# Altium schematic sheet conn.SchDoc
size A4; DocumentNumber: 11; SheetNumber: 11; SheetTotal: 11
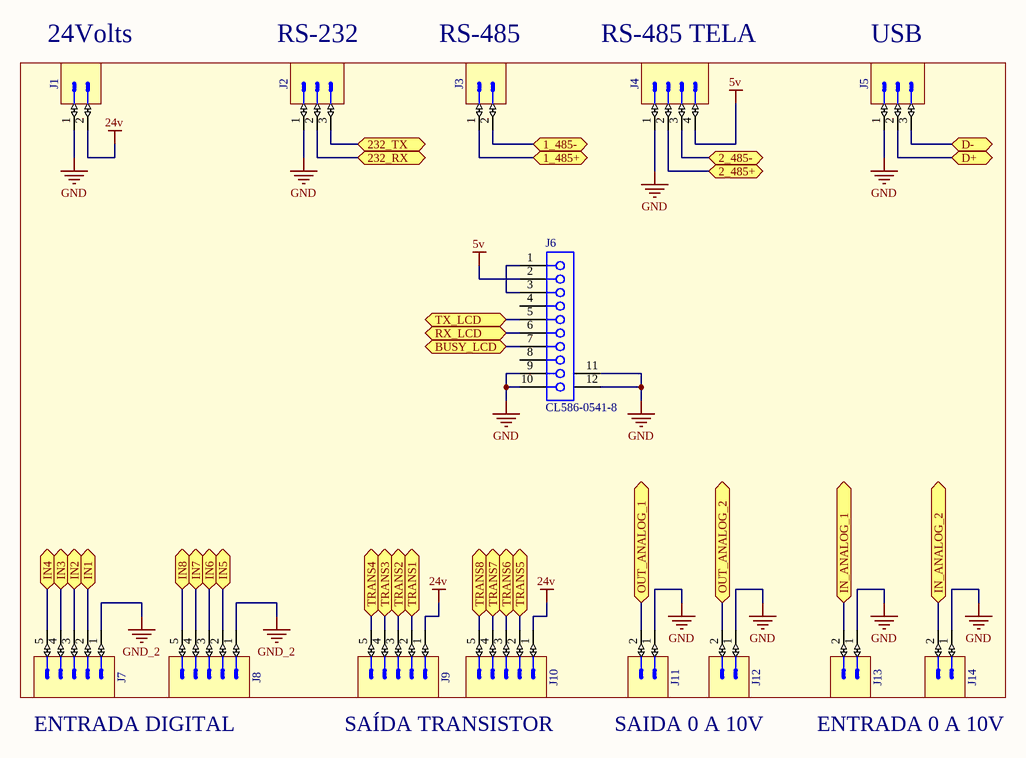
[diagram p0: conn.SchDoc]

## Parts
J1  (no value)  [PHOENIX_1757242]
J2  (no value)  [PHOENIX_1757255]
J3  (no value)  [PHOENIX_1757242]
J4  (no value)  [PHOENIX_1757268]
J5  (no value)  [PHOENIX_1757255]
J6  CL586-0541-8  [FH12-22(10)SA-1SH]
J7  (no value)  [PHOENIX_1803303]
J8  (no value)  [PHOENIX_1803303]
J9  (no value)  [PHOENIX_1803303]
J10  (no value)  [PHOENIX_1803303]
J11  (no value)  [PHOENIX_1757242]
J12  (no value)  [PHOENIX_1757242]
J13  (no value)  [PHOENIX_1757242]
J14  (no value)  [PHOENIX_1757242]

## Ports
1_485+, 1_485-, 2_485+, 2_485-, 232_RX, 232_TX, BUSY_LCD, D+, D-, IN1, IN2, IN3, IN4, IN5, IN6, IN7, IN8, IN_ANALOG_1, IN_ANALOG_2, OUT_ANALOG_1, OUT_ANALOG_2, RX_LCD, TRANS1, TRANS2, TRANS3, TRANS4, TRANS5, TRANS6, TRANS7, TRANS8, TX_LCD

## Nets
5v: J4.4 J6.2
24v: J1.2 J9.1 J10.1
GND: J1.1 J2.1 J4.1 J5.1 J6.9 J6.10 J6.11(MH1) J6.12(MH2) J11.1 J12.1 J13.1 J14.1
GND_2: J7.1 J8.1
1_485+: J3.1 ; port 1_485+
1_485-: J3.2 ; port 1_485-
2_485+: J4.2 ; port 2_485+
2_485-: J4.3 ; port 2_485-
232_RX: J2.2 ; port 232_RX
232_TX: J2.3 ; port 232_TX
BUSY_LCD: J6.7 ; port BUSY_LCD
D+: J5.2 ; port D+
D-: J5.3 ; port D-
IN1: J7.2 ; port IN1
IN2: J7.3 ; port IN2
IN3: J7.4 ; port IN3
IN4: J7.5 ; port IN4
IN5: J8.2 ; port IN5
IN6: J8.3 ; port IN6
IN7: J8.4 ; port IN7
IN8: J8.5 ; port IN8
IN_ANALOG_1: J13.2 ; port IN_ANALOG_1
IN_ANALOG_2: J14.2 ; port IN_ANALOG_2
OUT_ANALOG_1: J11.2 ; port OUT_ANALOG_1
OUT_ANALOG_2: J12.2 ; port OUT_ANALOG_2
RX_LCD: J6.6 ; port RX_LCD
TRANS1: J9.2 ; port TRANS1
TRANS2: J9.3 ; port TRANS2
TRANS3: J9.4 ; port TRANS3
TRANS4: J9.5 ; port TRANS4
TRANS5: J10.2 ; port TRANS5
TRANS6: J10.3 ; port TRANS6
TRANS7: J10.4 ; port TRANS7
TRANS8: J10.5 ; port TRANS8
TX_LCD: J6.5 ; port TX_LCD
NetJ6_1: J6.1 J6.3

Not connected (* = marked no-connect by the designer): J6 4 8

## Notes on the sheet
- 24Volts
- RS-232
- RS-485
- RS-485 TELA
- USB
- ENTRADA DIGITAL
- SAÍDA TRANSISTOR
- SAIDA 0 A 10V
- ENTRADA 0 A 10V

## Library data of the parts
J1 J3 J11-J14 = PHOENIX_1757242: Connector 2 Male; Part Description: 12A, 250V, Pitch 5.08mm, 2 Positions Header; Manufacturer: PHOENIX CONTACT; Manufacturer Part Number: 1757242 (MSTBA 2,5/ 2-G-5,08); Part Number: PHOENIX_1757242; Component Kind: Standard; Component Type: Standard; Pin Count: 2; Mounted: Yes; Socket: No; SMD: No; Status: None; ComponentHeight: 8.6mm; HelpURL: \\cern.ch\dfs\Applications\Altium\Datasheets\PHOENIX_1757242.pdf; Author: CERN DEM JLC; CreateDate: 10/02/2010; LatestRevisionDate: 26/04/2010; Table: PHOENIX
J2 J5 = PHOENIX_1757255: Connector 3 Male; Part Description: 12A, 250V, Pitch 5.08mm, 3 Positions Header; Manufacturer: PHOENIX CONTACT; Manufacturer Part Number: 1757255 (MSTBA 2,5/ 3-G-5,08); Part Number: PHOENIX_1757255; Component Kind: Standard; Component Type: Standard; Pin Count: 3; Mounted: Yes; Socket: No; SMD: No; Status: None; ComponentHeight: 8.6mm; HelpURL: \\cern.ch\dfs\Applications\Altium\Datasheets\PHOENIX_1757255.pdf; Author: CERN DEM JLC; CreateDate: 10/02/2010; LatestRevisionDate: 26/04/2010; Table: PHOENIX
J4 = PHOENIX_1757268: Connector 4 Male; Part Description: 12A, 250V, Pitch 5.08mm, 4 Positions Header; Manufacturer: PHOENIX CONTACT; Manufacturer Part Number: 1757268 (MSTBA 2,5/ 4-G-5,08); Part Number: PHOENIX_1757268; Component Kind: Standard; Component Type: Standard; Pin Count: 4; Mounted: Yes; Socket: No; SMD: No; Status: None; ComponentHeight: 8.6mm; HelpURL: \\cern.ch\dfs\Applications\Altium\Datasheets\PHOENIX_1757268.pdf; Author: CERN DEM JLC; CreateDate: 10/02/2010; LatestRevisionDate: 26/04/2010; Table: PHOENIX
J6 = CL586-0541-8: FH12 Series, "Flip-Lock" SMT/ZIF FFC/FPC Connector - 1.0mm Spaced Bottom Eccentric Contact; Positions: 10; ContactMaterial: Phosphor Bronze; Current: 0.5A; PCB_Layout: Complies with manufacturer's recommendation.; Note: Pad dimensions follow nominal values, Suitable for Wave Soldering, Adjust for Re-flow.; Published: 17-Jul-2002; DatasheetVersion: 13-Nov-2000; PackageVersion: 13-Nov-2000; PackageReference: FH12-22(10)SA-1SH; Publisher: Altium Limited; ComponentLink1Description: Manufacturer Link; ComponentLink1URL: http://www.hiroseusa.com/; ComponentLink2Description: Datasheet; ComponentLink2URL: http://www.hirose.co.jp/cataloge_hp/e58605370.pdf
J7-J10 = PHOENIX_1803303: Connector 5 Male; Part Description: 8A 160 V, Pitch: 3.81mm, 5 Positions  Right Angled Header; Manufacturer: PHOENIX CONTACT; Manufacturer Part Number: 1803303 (MC 1,5/ 5-G-3,81); Part Number: PHOENIX_1803303; Component Kind: Standard; Component Type: Standard; Pin Count: 5; Mounted: Yes; Socket: No; SMD: No; Status: None; ComponentHeight: 7.25mm; HelpURL: \\cern.ch\dfs\Applications\Altium\Datasheets\PHOENIX_1803303.pdf; Author: CERN DEM JLC; CreateDate: 11/06/2013; LatestRevisionDate: 11/06/2013; Table: PHOENIX